# Altium schematic sheet Peripherals.SchDoc: Joystick, ACP, LEDs and Push Button
size A4; Date: 25-FEB-2015; Author: A.B; CompanyName: STMicroelectronics; Address1: 12, Rue Jules HOROWITZ; Address2: 38019 Grenoble; Address3: FRANCE; DocumentNumber: MB1191; Revision: B-02; SheetNumber: 3; SheetTotal: 13; Project: STM32F746G-DISCO
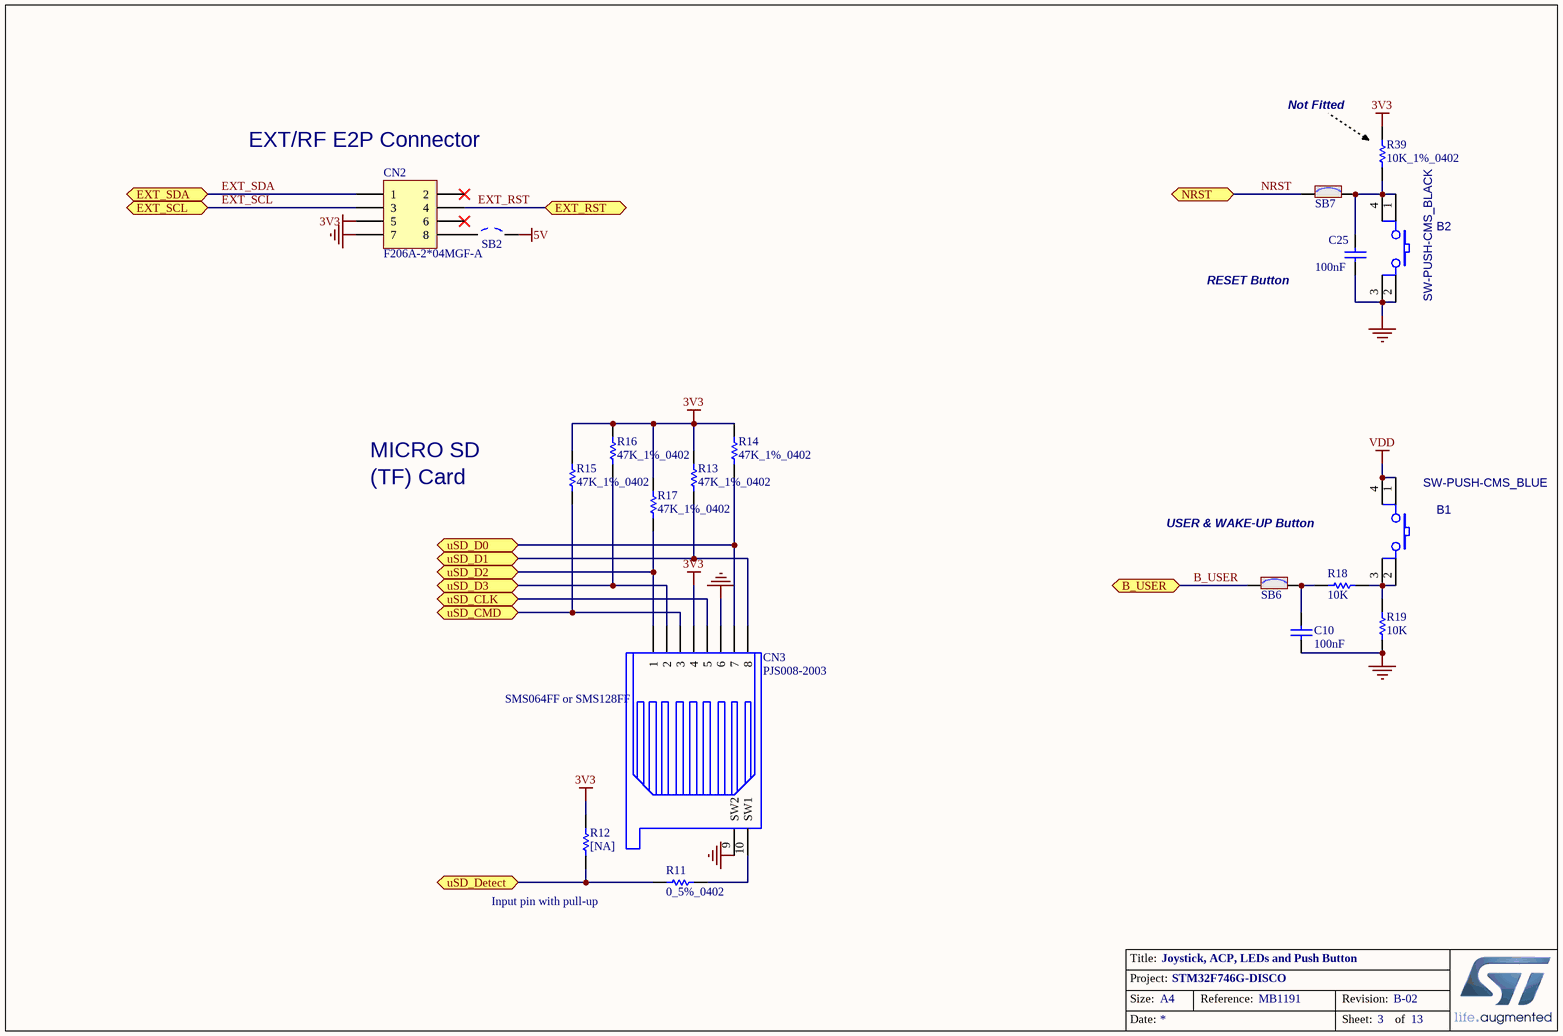
[diagram p0: Peripherals.SchDoc]

## Parts
B1  SW-PUSH-CMS_BLUE  [BP1CMS]
B2  SW-PUSH-CMS_BLACK  [BP1CMS]
C10  100nF  [0402C]
C25  100nF  [0402C]
CN2  F206A-2*04MGF-A  [SSM-104-L-DH]
CN3  PJS008-2003  [MSD_PJS008]
R11  0_5%_0402  [0402R]
R12  [NA]  [0402R]
R13  47K_1%_0402  [0402R]
R14  47K_1%_0402  [0402R]
R15  47K_1%_0402  [0402R]
R16  47K_1%_0402  [0402R]
R17  47K_1%_0402  [0402R]
R18  10K  [0402R]
R19  10K  [0402R]
R39  10K_1%_0402  [0402R]
SB2  Solder Bridge OFF  [JP2_SMD]  (value not drawn)
SB6  Solder Bridge ON  [JP2_SMD]  (value not drawn)
SB7  Solder Bridge ON  [JP2_SMD]  (value not drawn)

## Ports
B_USER, EXT_RST, EXT_SCL, EXT_SDA, NRST, uSD_CLK, uSD_CMD, uSD_D0, uSD_D1, uSD_D2, uSD_D3, uSD_Detect

## Nets
3V3: CN2.5 CN3.4 R12.2 R13.2 R14.2 R15.2 R16.2 R17.2 R39.2
5V: SB2.2
GND: B2.2 B2.3 C10.1 C25.1 CN2.7 CN3.6 CN3.9(SW2) R19.1
VDD: B1.1 B1.4
B_USER: SB6.1 ; port B_USER
EXT_RST: CN2.4 ; port EXT_RST
EXT_SCL: CN2.3 ; port EXT_SCL
EXT_SDA: CN2.1 ; port EXT_SDA
NRST: SB7.1 ; port NRST
uSD_CLK: CN3.5 ; port uSD_CLK
uSD_CMD: CN3.3 R15.1 ; port uSD_CMD
uSD_D0: CN3.7 R14.1 ; port uSD_D0
uSD_D1: CN3.8 R13.1 ; port uSD_D1
uSD_D2: CN3.1 R17.1 ; port uSD_D2
uSD_D3: CN3.2 R16.1 ; port uSD_D3
uSD_Detect: R11.1 R12.1 ; port uSD_Detect
NetB1_2: B1.2 B1.3 R18.2 R19.2
NetB2_1: B2.1 B2.4 C25.2 R39.1 SB7.2
NetC10_2: C10.2 R18.1 SB6.2
NetCN2_8: CN2.8 SB2.1
NetCN3_10: CN3.10(SW1) R11.2

Not connected (* = marked no-connect by the designer): CN2 2* 6*

## Notes on the sheet
- (near R39) Not Fitted
- (near CN2) EXT/RF E2P Connector
- RESET Button
- MICRO SD
- (TF) Card
- USER & WAKE-UP Button
- (near CN3) SMS064FF or SMS128FF
- Input pin with pull-up
- Title:
- Project:
- Size:
- Date:
- A4
- Reference:
- Sheet:
- Revision:
- of

## Library data of the parts
B1 = SW-PUSH-CMS_BLUE: Non-Open Push-Button 0.1A 24V; Manuf_2: FARNELL; Manuf_Part_2: 535-930; Manuf_1: wealthmetal; Manuf_Part_1: TD0341X-G01-BLU; Ref St: 9180120; Description: Non-Open Push Button,Blue 0.1A 24V,Square head,6*6,SMT,180Degree,TD-0341X-GO1,wealthmetal; Distrib: JFVNY; ECCN_US/EU: n/a
B2 = SW-PUSH-CMS_BLACK: Non-Open Push-Button 0.1A 24V; Manuf_2: FARNELL; Manuf_Part_2: 535-930; Manuf_1: wealthmetal; Manuf_Part_1: TD0341X-G01-BLA; Ref St: 9180120; Description: Non-Open Push Button,Black 0.1A 24V,Square head,6*6,SMT,180Degree,TD-0341X-GO1,wealthmetal; Distrib: JFVNY; ECCN_US/EU: n/a
C10 C25 = Cap_100nF_X7R_10%_0402: Capacitor,100nF,16V,X7R,10%,0402,YAGEO; Manuf_Part_1: CC0402KRX7R7BB104; Revision: July-2002: Re-released for DXP Platform.; Value: 100nF; Order: CC0402KRX7R7BB104; Manuf_1: YAGEO
CN2 = F206A-2*04MGF-A: Header, 5-Pins, Horizontal Dual row, female SMD; Manuf_2: SAMTEC; Manuf_1: TOWNES; Revision: 17-Jul-2002: Re-released for DXP Platform.; Manuf_Part_2: SSM-104-L-DH; ECCN_US/EU: n/a; Manuf_Part_1: F206A-2*04MGF-A
CN3 = microSD-PJS008-2003: Memory Card Connectors MicroSD Card Conn Revrs Mnt Push-Push; Manuf_Part_1: PJS008-2003-1; Manuf_1: YAMAICHI; Distrib: *; Order: PJS008-2003-1; ECCN_US/EU: n/a
R11 = Res_0_5%_0402: Resistor,0,0402,5%,YAGEO; Manuf_Part_1: RC0402JR-070RL; Value: 0; Order: 2363467; ECCN_US/EU: n/a; Manuf_1: YAGEO; Distrib: FARNELL
R12 = Res_NA_0402: Resistor,[NA],0402; Fitted: NO; Value: [NA]; ECCN_US/EU: n/a
R13-R17 = Res_47K_1%_0402: Resistor,47K,0402,1%,YAGEO; Manuf_Part_1: RC0402FR-0747KL; Order: 9239430; Value: 47K; Manuf_1: YAGEO; ECCN_US/EU: n/a; Distrib: FARNELL
R18 R19 = Res_10K_1%_0402: Resistor,10K,0402,1%,YAGEO; Manuf_Part_1: RC0402FR-0710KL; Value: 10K; Manuf_1: YAGEO; Order: RC0402FR-0710KL; ECCN_US/EU: n/a
R39 = Res_10K_1%_0402: Resistor,10K,0402,1%,YAGEO; Manuf_Part_1: RC0402FR-0710KL; Fitted: NO; Value: 10K; Manuf_1: YAGEO; Order: RC0402FR-0710KL; ECCN_US/EU: n/a
SB2 = SB_OFF: Solder: NO; Revision: July-2002: Re-released for DXP Platform.; ECCN_US/EU: n/a
SB6 SB7 = SB_ON: Solder: YES; Revision: July-2002: Re-released for DXP Platform.; ECCN_US/EU: n/a